# Altium schematic sheet Photo-Diode Board.SchDoc
size A
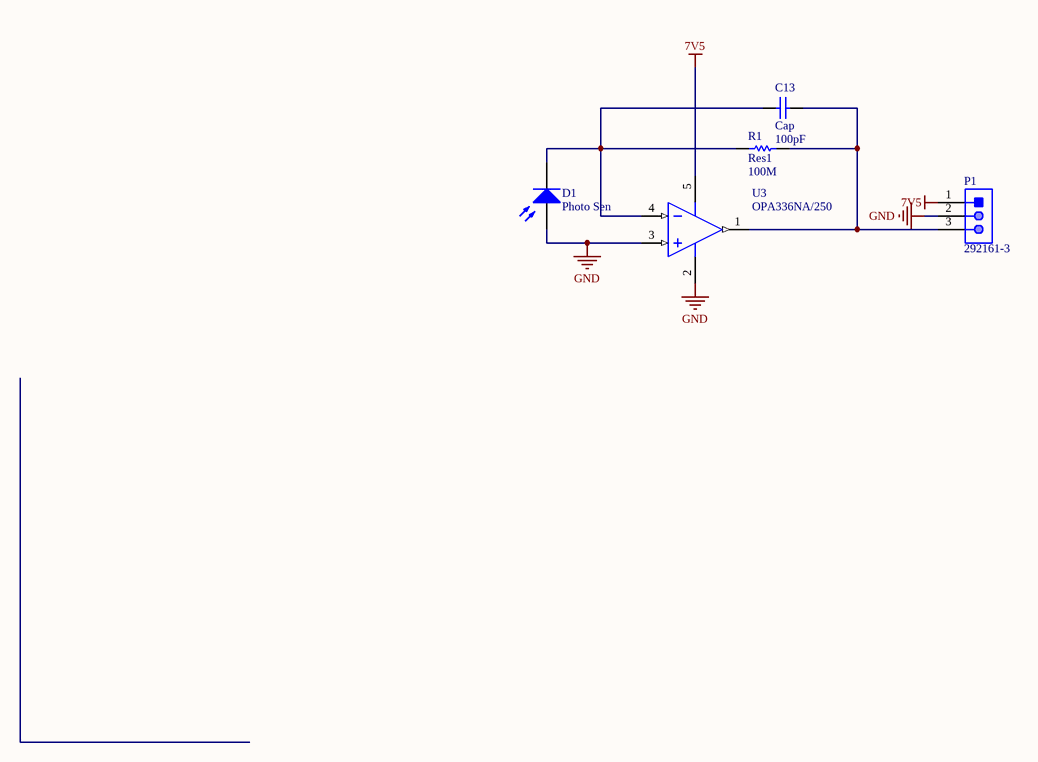
[diagram p0: Photo-Diode Board.SchDoc]

## Parts
C13  Cap  value 100pF  [0402-A]
D1  Photo Sen  [TO-18]
P1  292161-3  [TECO-292161-3_V]
R1  Res1  value 100M  [1608[0603]]
U3  OPA336NA/250  [DBV0005A_M]

## Nets
7V5: P1.1 U3.5(V+)
GND: D1.1(A) P1.2 U3.2(V-) U3.3(IN+)
NetC13_1: C13.1 D1.2(K) R1.1 U3.4(IN-)
NetC13_2: C13.2 P1.3 R1.2 U3.1(OUT)

## Library data of the parts
C13 = Cap: Capacitor; Published: 8-Jun-2000; LatestRevisionDate: 17-Jul-2002; LatestRevisionNote: Re-released for DXP Platform.; PackageReference: RAD-0.3; Publisher: Altium Limited; PackageDescription: Radial Cap, Thru-Hole; 2 Leads; 0.3 in Pin Spacing
D1 = Photo Sen: Photosensitive Diode; Published: 24-Mar-1999; LatestRevisionDate: 17-Jul-2002; LatestRevisionNote: Re-released for DXP Platform.; PackageReference: PIN2; Publisher: Altium Limited
P1 = CMP-2000-05551-1: Male Header, Pitch 2 mm, 1 x 3 Position, Height 6.8 mm, Tail Length 3.2 mm, -40 to 105 degC, RoHS, Bulk; Manufacturer: TE Connectivity; SVHC: NoSVHC(15-Jun-2015); Pitch Spacing: 2mm; Contact Termination Type: ThroughHole; No. of Rows: 1Rows; No. of Contacts: 3Contacts; Product Range: AMPCTSeries; Mounting Technology: ThroughHole; Manufacturer URL: http://www.te.com/; Contact Material: Brass; Datasheet URL: http://www.te.com/commerce/DocumentDelivery/DDEController?Action=showdoc&DocId=Customer+Drawing%7F292161%7FP1%7Fpdf%7FEnglish%7FENG_CD_292161_P1.pdf%7F292161-3; Package Reference: 292161-3; Contact Plating: TinPlatedContacts; Gender: Header; Datasheet Version: Rev. P1, 06/2016; Package Description: Male Header, Pitch 2 mm, 1 x 3 Position, Height 6.8 mm, Tail Length 3.2 mm
R1 = Res1: Resistor; Published: 8-Jun-2000; LatestRevisionDate: 17-Jul-2002; LatestRevisionNote: Re-released for DXP Platform.; PackageReference: AXIAL-0.3; Publisher: Altium Limited; PackageDescription: Axial Device, Thru-Hole; 2 Leads; 0.3 in Pin Spacing
U3 = CMP-0272-00910-3: Single-Supply, MicroPower CMOS Operational Amplifier MicroAmplifier(TM) Series, 2.3 to 5.5 V, -55 to 125 degC, 5-pin SOT23 (DBV5), Green (RoHS & no Sb/Br); Manufacturer: Texas Instruments; Slew Rate(Typ)(V/us): 0.03; Iq per channel(Max)(mA): 0.032; Number of Channels: 1; Offset Drift(Typ)(uV/C): 1.5; IIB(Max)(pA): 10; Total Supply Voltage(Max)(+5V is 5, +/-5V is 10): 5.5; Vio (25C)(Max)(mV): 0.5; CMRR(Min)(dB): 76; Total Supply Voltage(Min)(+5V is 5, +/-5V is 10): 2.3; Sub Family: Low Input Bias Current Amp (<=10pA), Low Offset Voltage Amplifier (<=500uV), Low Power Amp (<=500uA), Low Supply Voltage Amplifier (<=2.7V), Precision Amplifier; Vn at 1kHz(Typ)(nV/rtHz): 40; DatasheetVersion: SBOS068C; ComponentLink1URL: http://www.ti.com/; ComponentLink2Description: Datasheet; PackageReference: DBV0005A; ComponentLink3Description: Package Specification; ComponentLink2URL: http://www.ti.com/general/docs/lit/getliterature.tsp?genericPartNumber=OPA336&fileType=pdf; Mounting Technology: Surface Mount; Eco-Plan: Green (RoHS & no Sb/Br); Code_JEDEC: MO-178; ComponentLink3URL: http://www.ti.com/litv/pdf/mpds018i; PackageDescription: 5-Pin Plastic Small Outline, Body 1.6 x 2.9 mm, Pitch 0.95 mm; PartNumber: OPA336NA/250; PackageVersion: 4073253-4/K, 03/2006; ComponentLink1Description: Manufacturer URL